# Altium project led_pwr_7030_x56.PrjPcb
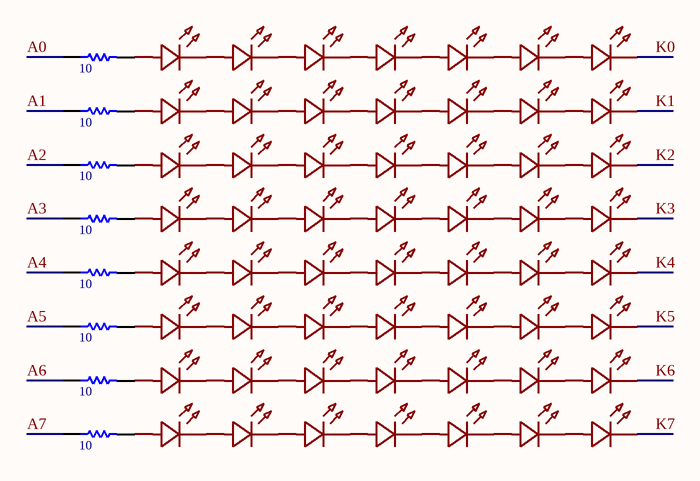
[diagram p0: main.SchDoc]
1 sheet, 64 parts. Net scope: global (net labels, ports and power ports of the same name join across sheets).
Board file: board.PcbDoc

## Sheet main.SchDoc: Main
size A4; Revision: 1; SheetNumber: 1; SheetTotal: 2

### Parts
R1  10  [R2512]
R2  10  [R2512]
R3  10  [R2512]
R4  10  [R2512]
R5  10  [R2512]
R6  10  [R2512]
R7  10  [R2512]
R8  10  [R2512]
U1  (no value)  [LED-SMD_7030]
U2  (no value)  [LED-SMD_7030]
U3  (no value)  [LED-SMD_7030]
U4  (no value)  [LED-SMD_7030]
U5  (no value)  [LED-SMD_7030]
U6  (no value)  [LED-SMD_7030]
U7  (no value)  [LED-SMD_7030]
U8  (no value)  [LED-SMD_7030]
U9  (no value)  [LED-SMD_7030]
U10  (no value)  [LED-SMD_7030]
U11  (no value)  [LED-SMD_7030]
U12  (no value)  [LED-SMD_7030]
U13  (no value)  [LED-SMD_7030]
U14  (no value)  [LED-SMD_7030]
U15  (no value)  [LED-SMD_7030]
U16  (no value)  [LED-SMD_7030]
U17  (no value)  [LED-SMD_7030]
U18  (no value)  [LED-SMD_7030]
U19  (no value)  [LED-SMD_7030]
U20  (no value)  [LED-SMD_7030]
U21  (no value)  [LED-SMD_7030]
U22  (no value)  [LED-SMD_7030]
U23  (no value)  [LED-SMD_7030]
U24  (no value)  [LED-SMD_7030]
U25  (no value)  [LED-SMD_7030]
U26  (no value)  [LED-SMD_7030]
U27  (no value)  [LED-SMD_7030]
U28  (no value)  [LED-SMD_7030]
U29  (no value)  [LED-SMD_7030]
U30  (no value)  [LED-SMD_7030]
U31  (no value)  [LED-SMD_7030]
U32  (no value)  [LED-SMD_7030]
U33  (no value)  [LED-SMD_7030]
U34  (no value)  [LED-SMD_7030]
U35  (no value)  [LED-SMD_7030]
U36  (no value)  [LED-SMD_7030]
U37  (no value)  [LED-SMD_7030]
U38  (no value)  [LED-SMD_7030]
U39  (no value)  [LED-SMD_7030]
U40  (no value)  [LED-SMD_7030]
U41  (no value)  [LED-SMD_7030]
U42  (no value)  [LED-SMD_7030]
U43  (no value)  [LED-SMD_7030]
U44  (no value)  [LED-SMD_7030]
U45  (no value)  [LED-SMD_7030]
U46  (no value)  [LED-SMD_7030]
U47  (no value)  [LED-SMD_7030]
U48  (no value)  [LED-SMD_7030]
U49  (no value)  [LED-SMD_7030]
U50  (no value)  [LED-SMD_7030]
U51  (no value)  [LED-SMD_7030]
U52  (no value)  [LED-SMD_7030]
U53  (no value)  [LED-SMD_7030]
U54  (no value)  [LED-SMD_7030]
U55  (no value)  [LED-SMD_7030]
U56  (no value)  [LED-SMD_7030]

### Nets
A0: R1.1
A1: R2.1
A2: R3.1
A3: R4.1
A4: R5.1
A5: R6.1
A6: R7.1
A7: R8.1
K0: U7.2(K)
K1: U14.2(K)
K2: U21.2(K)
K3: U28.2(K)
K4: U35.2(K)
K5: U42.2(K)
K6: U49.2(K)
K7: U56.2(K)
NetR1_2: R1.2 U1.1(A)
NetR2_2: R2.2 U8.1(A)
NetR3_2: R3.2 U15.1(A)
NetR4_2: R4.2 U22.1(A)
NetR5_2: R5.2 U29.1(A)
NetR6_2: R6.2 U36.1(A)
NetR7_2: R7.2 U43.1(A)
NetR8_2: R8.2 U50.1(A)
NetU1_2: U1.2(K) U2.1(A)
NetU2_2: U2.2(K) U3.1(A)
NetU3_2: U3.2(K) U4.1(A)
NetU4_2: U4.2(K) U5.1(A)
NetU5_2: U5.2(K) U6.1(A)
NetU6_2: U6.2(K) U7.1(A)
NetU8_2: U8.2(K) U9.1(A)
NetU9_2: U9.2(K) U10.1(A)
NetU10_2: U10.2(K) U11.1(A)
NetU11_2: U11.2(K) U12.1(A)
NetU12_2: U12.2(K) U13.1(A)
NetU13_2: U13.2(K) U14.1(A)
NetU15_2: U15.2(K) U16.1(A)
NetU16_2: U16.2(K) U17.1(A)
NetU17_2: U17.2(K) U18.1(A)
NetU18_2: U18.2(K) U19.1(A)
NetU19_2: U19.2(K) U20.1(A)
NetU20_2: U20.2(K) U21.1(A)
NetU22_2: U22.2(K) U23.1(A)
NetU23_2: U23.2(K) U24.1(A)
NetU24_2: U24.2(K) U25.1(A)
NetU25_2: U25.2(K) U26.1(A)
NetU26_2: U26.2(K) U27.1(A)
NetU27_2: U27.2(K) U28.1(A)
NetU29_2: U29.2(K) U30.1(A)
NetU30_2: U30.2(K) U31.1(A)
NetU31_2: U31.2(K) U32.1(A)
NetU32_2: U32.2(K) U33.1(A)
NetU33_2: U33.2(K) U34.1(A)
NetU34_2: U34.2(K) U35.1(A)
NetU36_2: U36.2(K) U37.1(A)
NetU37_2: U37.2(K) U38.1(A)
NetU38_2: U38.2(K) U39.1(A)
NetU39_2: U39.2(K) U40.1(A)
NetU40_2: U40.2(K) U41.1(A)
NetU41_2: U41.2(K) U42.1(A)
NetU43_2: U43.2(K) U44.1(A)
NetU44_2: U44.2(K) U45.1(A)
NetU45_2: U45.2(K) U46.1(A)
NetU46_2: U46.2(K) U47.1(A)
NetU47_2: U47.2(K) U48.1(A)
NetU48_2: U48.2(K) U49.1(A)
NetU50_2: U50.2(K) U51.1(A)
NetU51_2: U51.2(K) U52.1(A)
NetU52_2: U52.2(K) U53.1(A)
NetU53_2: U53.2(K) U54.1(A)
NetU54_2: U54.2(K) U55.1(A)
NetU55_2: U55.2(K) U56.1(A)

### Library data of the parts
R1-R8 = RES: 10R 2512; P/N: RC2512JK-7W10RL; LCSC part number: C173291
U1-U56 = XL-C3570P8S11-62C3C2